# EAGLE schematic board (EAGLE 9.5.0)
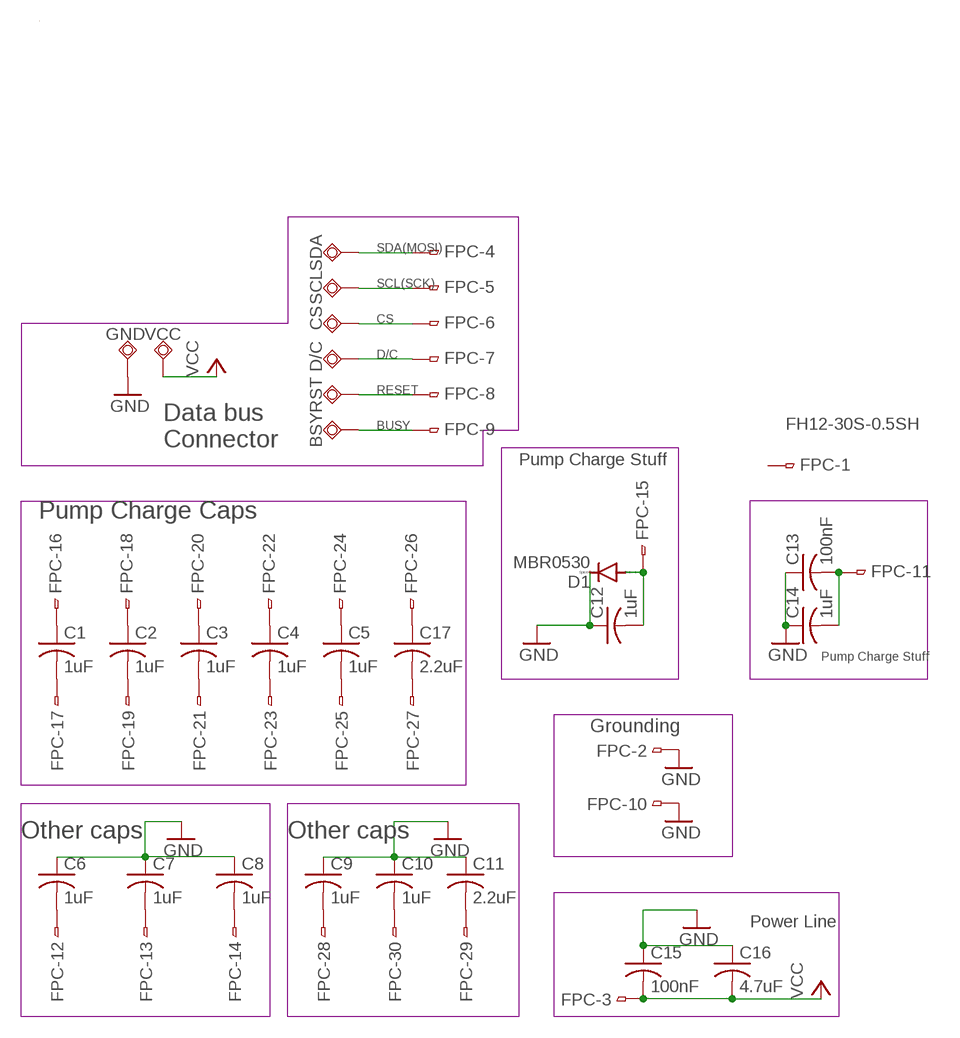
[diagram p0: schematic, sheet 1]

## Parts
BSY  TPSQTP18SQ  [TP18SQ]
C1  1uF  C-USC0805  [C0805]
C2  1uF  C-USC0805  [C0805]
C3  1uF  C-USC0805  [C0805]
C4  1uF  C-USC0805  [C0805]
C5  1uF  C-USC0805  [C0805]
C6  1uF  C-USC0805  [C0805]
C7  1uF  C-USC0805  [C0805]
C8  1uF  C-USC0805  [C0805]
C9  1uF  C-USC0805  [C0805]
C10  1uF  C-USC0805  [C0805]
C11  2.2uF  C-USC1206  [C1206]
C12  1uF  C-USC0805  [C0805]
C13  100nF  C-USC0805  [C0805]
C14  1uF  C-USC0805  [C0805]
C15  100nF  C-USC0805  [C0805]
C16  4.7uF  C-USC0805  [C0805]
C17  2.2uF  C-USC1206  [C1206]
CS  TPSQTP18SQ  [TP18SQ]
D1  MBR0530  CGRM4001-G  [SOD-123_MINI-SMA]
D/C  TPSQTP18SQ  [TP18SQ]
FPC  FH12-30S-0.5SH  [FH12-30S-0.5SH]
GND  TPSQTP18SQ  [TP18SQ]
RST  TPSQTP18SQ  [TP18SQ]
SCL  TPSQTP18SQ  [TP18SQ]
SDA  TPSQTP18SQ  [TP18SQ]
VCC  TPSQTP18SQ  [TP18SQ]

## Nets
BUSY: BSY.TP FPC.9
CS: CS.TP FPC.6
D/C: D/C.TP FPC.7
GND: C6.1 C7.1 C8.1 C9.1 C10.1 C11.1 C12.1 C13.1 C14.1 C15.1 C16.1 D1.C FPC.2 FPC.10 GND.TP
N$1: C1.1 FPC.16
N$2: C1.2 FPC.17
N$3: C2.1 FPC.18
N$4: C2.2 FPC.19
N$5: C3.1 FPC.20
N$6: C3.2 FPC.21
N$7: C4.1 FPC.22
N$8: C4.2 FPC.23
N$9: C5.1 FPC.24
N$10: C5.2 FPC.25
N$11: C6.2 FPC.12
N$12: C7.2 FPC.13
N$13: C8.2 FPC.14
N$14: C12.2 D1.A FPC.15
N$15: C11.2 FPC.29
N$16: C9.2 FPC.28
N$17: C10.2 FPC.30
N$18: C13.2 C14.2 FPC.11
N$19: C17.1 FPC.26
N$20: C17.2 FPC.27
RESET: FPC.8 RST.TP
SCL(SCK): FPC.5 SCL.TP
SDA(MOSI): FPC.4 SDA.TP
VCC: C15.2 C16.2 FPC.3 VCC.TP
Unconnected: FPC.1

## Notes on the sheet
- Data bus 
  Connector
- Pump Charge Stuff
- Pump Charge Caps
- Pump Charge Stuff
- Grounding
- Other caps | Other caps
- Power Line

## Library data of the parts
BSY CS D/C GND RST SCL SDA VCC = testpad:TPSQ: Test pad
C1-C17 = rcl:C-US: CAPACITOR, American symbol; SPICEPREFIX: C
D1 = diode:CGRM400*-G: Molded plasitc,JEDEC SOD-123/Mini SMA Source: Comchip CGRM4001-G.pdf
FPC = con-hirose:FH12-30S-0.5S: 0.5mm Pitch Connectors For FPC/FFC Source: Data sheet <http://www.hirose.co.jp/cataloge_hp/e58605370.pdf>; MPN: FH12-30S-0.5SH(55); OC_FARNELL: 1324555; OC_NEWARK: 34M6176